# EAGLE board io-board-b-b (EAGLE 8.4.3)
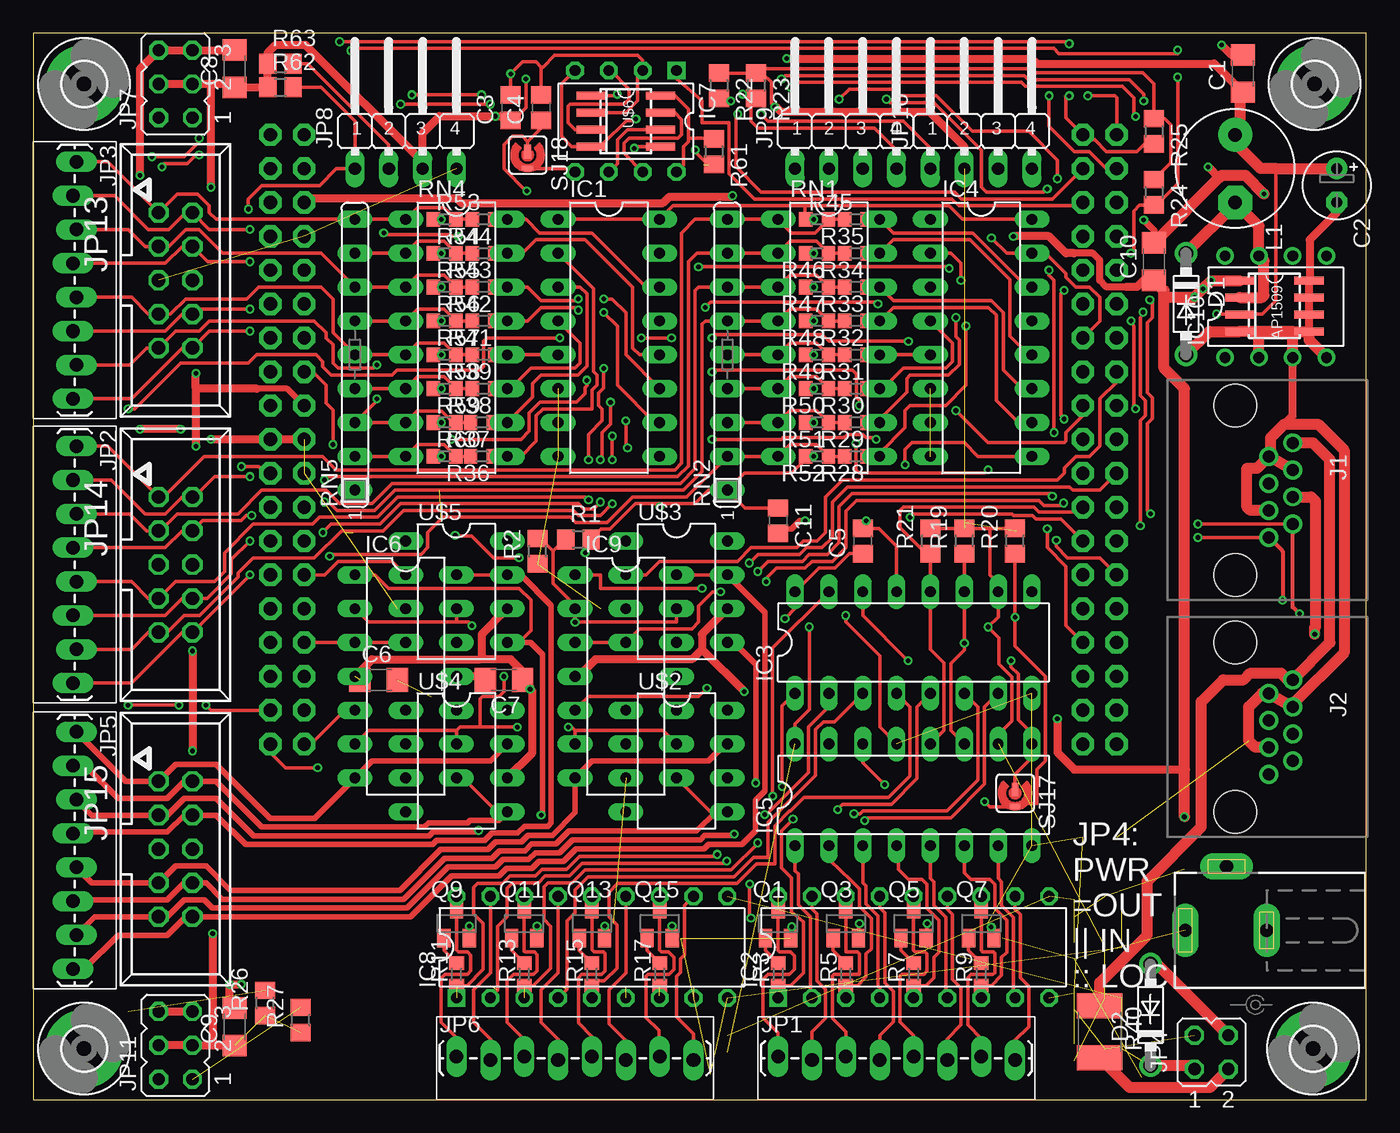
[diagram p2: board, top side]
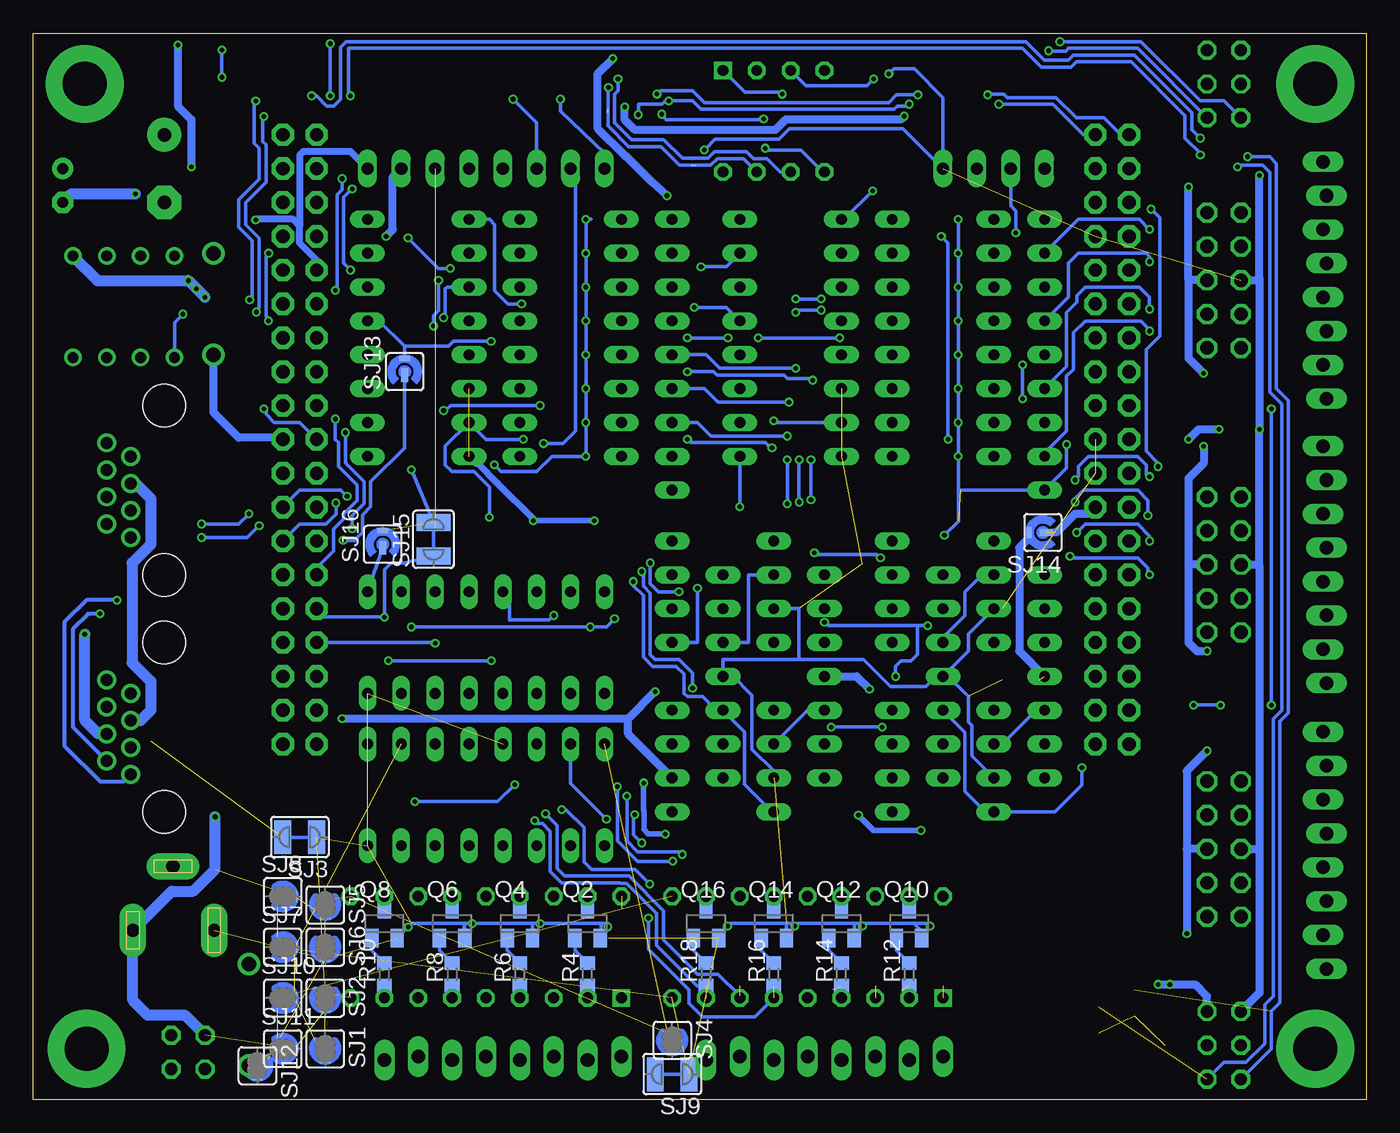
[diagram p3: board, bottom side, seen from below]

Size 100 x 80 mm. Coordinates in mm from the lower left corner, seen from the top.
Outline: 0,0 100,0 100,80 0,80 0,0
Copper layers (1*16): Top 0.035mm / dielectric 1.5mm / Bottom 0.035mm
Design rules "SeeedStudio_2layer_DRU_no_angle_20140221 *": minimum track width 6mil, minimum drill 12mil, track to track 10mil, track to pad 7mil, pad to pad 16mil, via to via 6mil, smd to smd 0mil, copper to edge 10mil, drill to drill 10mil, minimum pad ring 10mil, minimum via ring 6mil, stop-mask expansion 2mil, vias tented up to drill 100mil, thermal gap 10mil

## Footprints (pad centres in the part's own frame; a part is rotated, then mirrored left to right if it is on the bottom)
SO-08 = smd 0.6 x 2.2: 1 -1.905,-2.6; 2 -0.635,-2.6; 3 0.635,-2.6; 4 1.905,-2.6; 5 1.905,2.6; 6 0.635,2.6; 7 -0.635,2.6; 8 -1.905,2.6
C1206 = smd 1.6 x 1.8: 1 -1.4,0; 2 1.4,0
E2,5-5 = drill 0.813 pad 1.6: + -1.27,0 | drill 0.813 pad 1.6 octagon: - 1.27,0
C0805 = smd 1.3 x 1.5: 1 -0.95,0; 2 0.95,0
DO41-7.6 = drill 1.1 pad 1.7: A 3.81,0; C -3.81,0
3,3-PAD = drill 3.3 pad 5.842: B3,3 0,0
DIL16 = drill 0.813 long: 1 -8.89,-3.81; 2 -6.35,-3.81; 3 -3.81,-3.81; 4 -1.27,-3.81; 5 1.27,-3.81; 6 3.81,-3.81; 7 6.35,-3.81; 8 8.89,-3.81; 9 8.89,3.81; 10 6.35,3.81; 11 3.81,3.81; 12 1.27,3.81; 13 -1.27,3.81; 14 -3.81,3.81; 15 -6.35,3.81; 16 -8.89,3.81
DIL18-THIN = drill 0.813 square: 1 -10.16,-3.81 | drill 0.813 octagon: 2 -7.62,-3.81; 3 -5.08,-3.81; 4 -2.54,-3.81; 5 0,-3.81; 6 2.54,-3.81; 7 5.08,-3.81; 8 7.62,-3.81; 9 10.16,-3.81; 10 10.16,3.81; 11 7.62,3.81; 12 5.08,3.81; 13 2.54,3.81; 14 0,3.81; 15 -2.54,3.81; 16 -5.08,3.81; 17 -7.62,3.81; 18 -10.16,3.81
DIL14 = drill 0.813 long: 1 -7.62,-3.81; 2 -5.08,-3.81; 3 -2.54,-3.81; 4 0,-3.81; 5 2.54,-3.81; 6 5.08,-3.81; 7 7.62,-3.81; 8 7.62,3.81; 9 5.08,3.81; 10 2.54,3.81; 11 0,3.81; 12 -2.54,3.81; 13 -5.08,3.81; 14 -7.62,3.81
DIL08 = drill 0.813 square: 1 -3.81,-3.81 | drill 0.813 octagon: 2 -1.27,-3.81; 3 1.27,-3.81; 4 3.81,-3.81; 5 3.81,3.81; 6 1.27,3.81; 7 -1.27,3.81; 8 -3.81,3.81
DIL08' = drill 0.813 pad 1.27: 1 -3.81,-3.81; 2 -1.27,-3.81; 3 1.27,-3.81; 4 3.81,-3.81; 5 3.81,3.81; 6 1.27,3.81; 7 -1.27,3.81; 8 -3.81,3.81
RJ45-PULSE-E5J88 = drill 0.9 pad 1.422: 1 3.555,2.54; 2 2.535,4.32; 3 1.515,2.54; 4 0.495,4.32; 5 -0.495,2.54; 6 -1.515,4.32; 7 -2.535,2.54; 8 -3.555,4.32 | hole 3.2: 6.35,0; -6.35,0
DCJ0202 = drill 1 pad 2 long: 1 0,3.1; 2 4.8,0; 3 0,-3
1X08_TERMINAL = drill 1.016 long: 1 0,0.127; 2 2.54,-0.127; 3 5.08,0.127; 4 7.62,-0.127; 5 10.16,0.127; 6 12.7,-0.127; 7 15.24,0.127; 8 17.78,-0.127
JP2Q = drill 0.914 octagon: 1 -1.27,-1.27; 2 -1.27,1.27; 3 1.27,-1.27; 4 1.27,1.27
JP3Q = drill 0.914 octagon: 1 -2.54,-1.27; 2 -2.54,1.27; 3 0,-1.27; 4 0,1.27; 5 2.54,-1.27; 6 2.54,1.27
JP4F = drill 0.914 long: 1 -2.54,-1.27; 2 0,-1.27; 3 2.54,-1.27; 4 5.08,-1.27
CON10M = drill 1 octagon: 1 -5.08,-1.27; 2 -5.08,1.27; 3 -2.54,-1.27; 4 -2.54,1.27; 5 0,-1.27; 6 0,1.27; 7 2.54,-1.27; 8 2.54,1.27; 9 5.08,-1.27; 10 5.08,1.27
L5-8,5 = drill 1.016 pad 2.54: 1 -2.54,0 | drill 1.016 pad 2.54 octagon: 2 2.54,0
SOT23 = smd 1 x 1.4: 1 -0.95,-1.1; 2 0.95,-1.1; 3 0,1.1
R0805 = smd 1.3 x 1.5: 1 -0.95,0; 2 0.95,0
R0603 = smd 1 x 1.1: 1 -0.85,0; 2 0.85,0
PTC1812 = smd 1.9 x 3.4: 1 -1.95,0; 2 1.95,0
SIL9 = drill 0.813 long: 1 -10.16,0; 2 -7.62,0; 3 -5.08,0; 4 -2.54,0; 5 0,0; 6 2.54,0; 7 5.08,0; 8 7.62,0; 9 10.16,0
SJ-RND = smd 1.016 x 0.508: 1 -0.381,0 | smd 0.406 x 0.813: 2 0.889,0
SJW-C = smd 1.27 x 2.54: 1 -1.27,0; 2 1.27,0
SJ_RND2 = smd 1.016 x 0.508: P$1 -0.254,0 | smd 0.406 x 0.813: P$2 1.016,0
NUCLEO_BRD_BASE64 = drill 1 pad 1.676 octagon: 3V3 2.54,27.94; 5V2 2.54,25.4; AGND 63.5,7.62; AVDD 60.96,38.1; BOOT0 0,38.1; E5V 2.54,40.64; GND3 0,22.86; GND4 2.54,20.32; GND5 2.54,22.86; GND6 2.54,38.1; GND7 60.96,35.56; GND8 63.5,22.86; IOREF2 2.54,33.02; NC1-PF7 0,33.02; NC2-PF6 0,35.56; NC3 2.54,15.24; NC4 2.54,35.56; NC5-PD8 63.5,35.56; NC6-PB11 63.5,25.4; NC7-PF5 63.5,2.54; NC8-PF4 63.5,0; NRESET 2.54,30.48; PA0 2.54,12.7; PA1 2.54,10.16; PA2 60.96,2.54; PA3 60.96,0; PA4 2.54,7.62; PA5 60.96,33.02; PA6 60.96,30.48; PA7 60.96,27.94; PA8 60.96,17.78; PA9 60.96,20.32; PA10 60.96,5.08; PA11 63.5,30.48; PA12 63.5,33.02; PA13 0,30.48; PA14 0,27.94; PA15 0,25.4; PB0 2.54,5.08; PB1 63.5,17.78; PB2 63.5,20.32; PB3 60.96,7.62; PB4 60.96,12.7; PB5 60.96,10.16; PB6 60.96,25.4; PB7 0,20.32; PB8 60.96,43.18; PB9 60.96,40.64; PB10 60.96,15.24; PB12 63.5,27.94; PB13 63.5,10.16; PB14 63.5,12.7; PB15 63.5,15.24; PC0 2.54,0; PC1 2.54,2.54; PC2 0,2.54; PC3 0,0; PC4 63.5,5.08; PC5 63.5,40.64; PC6 63.5,43.18; PC7 60.96,22.86; PC8 63.5,45.72; PC9 60.96,45.72; PC10 0,45.72; PC11 2.54,45.72; PC12 0,43.18; PC13 0,17.78; PC14 0,15.24; PC15 0,12.7; PD2 2.54,43.18; PF0-PH0 0,10.16; PF1-PH1 0,7.62; U5V 63.5,38.1; VBAT 0,5.08; VDD 0,40.64; VIN2 2.54,17.78
DIL08-LONG = drill 0.813 long: 1 -3.81,-3.81; 2 -1.27,-3.81; 3 1.27,-3.81; 4 3.81,-3.81; 5 3.81,3.81; 6 1.27,3.81; 7 -1.27,3.81; 8 -3.81,3.81

## Placement (x,y rotation side)
+12V  9-15V  [POWER_USAGE]  91.69,7.11 270 top
AP1509  AP1509  [SO-08]  93.12,59.54 270 top
C1  [C1206]  90.73,76.99 90 top
C2  [E2,5-5]  97.79,68.58 270 top
C3  [C0805]  35.81,74.42 90 top
C4  [C0805]  38.1,74.42 90 top
C5  [C0805]  62.23,41.91 90 top
C6  [C1206]  25.91,31.5 0 top
C7  [C1206]  35.31,31.5 180 top
C8  [C1206]  15.11,77.34 90 top
C9  [C1206]  15.11,5.46 90 top
C10  [C1206]  84.07,62.87 90 top
C11  [C0805]  55.88,43.43 270 top
D1  [DO41-7.6]  86.49,59.69 270 top
D2  [DO41-7.6]  83.82,6.35 90 top
H1  MOUNT-PAD-ROUND3.3  [3,3-PAD]  3.81,76.2 0 top
H2  MOUNT-PAD-ROUND3.3  [3,3-PAD]  3.81,3.81 0 top
H3  MOUNT-PAD-ROUND3.3  [3,3-PAD]  96.01,3.81 0 top
H4  MOUNT-PAD-ROUND3.3  [3,3-PAD]  96.14,76.2 0 top
IC1  74166N  [DIL16]  43.18,57.15 270 top
IC2  [DIL18-THIN]  66.04,11.43 0 top
IC3  74HCT595N  [DIL16]  66.04,34.29 0 top
IC4  74166N  [DIL16]  71.12,57.15 270 top
IC5  74HCT595N  [DIL16]  66.04,22.86 0 top
IC6  LM324N  [DIL14]  27.94,31.75 270 top
IC7  PCA82C250  [DIL08]  44.45,73.41 180 top
IC8  [DIL18-THIN]  41.91,11.43 0 top
IC9  LM324N  [DIL14]  44.45,31.75 270 top
IC10  LM2574N-5.0  [DIL08']  93.22,59.49 0 top
J1  RJ45-JACKRJ45-PULSE-E5J00  [RJ45-PULSE-E5J88]  90.17,45.72 270 top
J2  RJ45-JACKRJ45-PULSE-E5J00  [RJ45-PULSE-E5J88]  90.17,27.94 270 top
J3  DCJ0202  [DCJ0202]  89.53,12.7 90 top
JP1  M08-SCREW  [1X08_TERMINAL]  55.88,3.1 0 top
JP2  M08-SCREW  [1X08_TERMINAL]  3.1,49.02 270 top
JP3  M08-SCREW  [1X08_TERMINAL]  3.1,70.36 270 top
JP4  [JP2Q]  88.39,3.56 0 top
JP5  M08-SCREW  [1X08_TERMINAL]  3.1,27.58 270 top
JP6  M08-SCREW  [1X08_TERMINAL]  31.75,3.1 0 top
JP7  [JP3Q]  10.67,76.2 90 top
JP8  [JP4F]  26.67,71.12 0 top
JP9  [JP4F]  59.69,71.12 0 top
JP10  [JP4F]  69.85,71.12 0 top
JP11  [JP3Q]  10.67,4.06 90 top
JP13  [CON10M]  10.67,61.47 270 top
JP14  [CON10M]  10.67,40.13 270 top
JP15  [CON10M]  10.67,18.8 270 top
L1  L-US  [L5-8,5]  90.17,69.85 270 top
Q1  [SOT23]  55.88,13.21 0 top
Q2  [SOT23]  58.42,13.21 0 bottom
Q3  [SOT23]  60.96,13.21 0 top
Q4  [SOT23]  63.5,13.21 0 bottom
Q5  [SOT23]  66.04,13.21 0 top
Q6  [SOT23]  68.58,13.21 0 bottom
Q7  [SOT23]  71.12,13.21 0 top
Q8  [SOT23]  73.66,13.21 0 bottom
Q9  [SOT23]  31.75,13.21 0 top
Q10  [SOT23]  34.29,13.21 0 bottom
Q11  [SOT23]  36.83,13.21 0 top
Q12  [SOT23]  39.37,13.21 0 bottom
Q13  [SOT23]  41.91,13.21 0 top
Q14  [SOT23]  44.45,13.21 0 bottom
Q15  [SOT23]  46.99,13.21 0 top
Q16  [SOT23]  49.53,13.21 0 bottom
R1  10k  [R0805]  40.89,42.04 0 top
R2  10k  [R0805]  37.85,41.15 90 top
R3  [R0603]  55.88,9.4 90 top
R4  [R0603]  58.42,9.4 90 bottom
R5  [R0603]  60.96,9.4 90 top
R6  [R0603]  63.5,9.4 90 bottom
R7  [R0603]  66.04,9.4 90 top
R8  [R0603]  68.58,9.4 90 bottom
R9  [R0603]  71.12,9.4 90 top
R10  [R0603]  73.66,9.4 90 bottom
R11  [R0603]  31.75,9.4 90 top
R12  [R0603]  34.29,9.4 90 bottom
R13  [R0603]  36.83,9.4 90 top
R14  [R0603]  39.37,9.4 90 bottom
R15  [R0603]  41.91,9.4 90 top
R16  [R0603]  44.45,9.4 90 bottom
R17  [R0603]  46.99,9.4 90 top
R18  [R0603]  49.53,9.4 90 bottom
R19  [R0805]  69.85,41.91 90 top
R20  [R0805]  73.66,41.91 90 top
R21  [R0805]  67.31,41.91 90 top
R22  [R0805]  51.44,76.07 270 top
R23  [R0805]  54.23,76.07 270 top
R24  [R0805]  84.07,68.07 270 top
R25  [R0805]  84.07,72.64 270 top
R26  [R0805]  17.4,7.24 90 top
R27  [R0805]  20.07,5.97 90 top
R28  [R0603]  61.72,48.26 180 top
R29  [R0603]  61.72,50.8 180 top
R30  [R0603]  61.72,53.34 180 top
R31  [R0603]  61.72,55.88 180 top
R32  [R0603]  61.72,58.42 180 top
R33  [R0603]  61.72,60.96 180 top
R34  [R0603]  61.72,63.5 180 top
R35  [R0603]  61.72,66.04 180 top
R36  [R0603]  33.66,48.26 180 top
R37  [R0603]  33.66,50.8 180 top
R38  [R0603]  33.78,53.34 180 top
R39  [R0603]  33.78,55.88 180 top
R40  0ZCG0035AF2C  [PTC1812]  80.01,5.08 270 top
R41  [R0603]  33.78,58.42 180 top
R42  [R0603]  33.78,60.96 180 top
R43  [R0603]  33.78,63.5 180 top
R44  [R0603]  33.78,66.04 180 top
R45  [R0603]  58.8,66.04 0 top
R46  [R0603]  58.8,63.5 180 top
R47  [R0603]  58.8,60.96 180 top
R48  [R0603]  58.8,58.42 180 top
R49  [R0603]  58.8,55.88 180 top
R50  [R0603]  58.8,53.34 180 top
R51  [R0603]  58.8,50.8 180 top
R52  [R0603]  58.8,48.26 180 top
R53  [R0603]  30.86,66.04 0 top
R54  [R0603]  30.86,63.5 0 top
R55  [R0603]  30.86,60.96 0 top
R56  [R0603]  30.86,58.42 0 top
R57  [R0603]  30.86,55.88 0 top
R58  [R0603]  30.86,53.34 0 top
R59  [R0603]  30.86,50.8 0 top
R60  [R0603]  30.86,48.26 0 top
R61  [R0805]  51.05,71.12 270 top
R62  [R0805]  18.54,75.95 0 top
R63  [R0805]  18.54,77.72 0 top
RN1  [DIL16]  59.69,57.15 270 top
RN2  10K  [SIL9]  52.07,55.88 90 top
RN4  [DIL16]  31.75,57.15 270 top
RN5  10K  [SIL9]  24.13,55.88 90 top
SJ1  [SJ-RND]  78.11,3.81 270 bottom
SJ2  [SJ-RND]  78.11,7.62 270 bottom
SJ3  [SJW-C]  80.01,19.68 180 bottom
SJ4  [SJ-RND]  52.07,4.45 270 bottom
SJ5  [SJ-RND]  78.11,14.61 270 bottom
SJ6  [SJ-RND]  78.11,11.43 270 bottom
SJ7  [SJ-RND]  81.28,11.43 0 bottom
SJ8  [SJ-RND]  81.28,15.24 0 bottom
SJ9  [SJW-C]  52.07,1.91 180 bottom
SJ10  [SJ-RND]  81.28,7.62 0 bottom
SJ11  [SJ-RND]  81.28,3.81 0 bottom
SJ12  [SJ-RND]  83.19,2.54 270 bottom
SJ13  [SJ_RND2]  72.14,54.61 90 bottom
SJ14  [SJ_RND2]  24.26,42.55 180 bottom
SJ15  [SJW-C]  69.98,42.04 90 bottom
SJ16  [SJ_RND2]  73.79,41.66 90 bottom
SJ17  [SJ_RND2]  73.66,22.99 270 top
SJ18  [SJ_RND2]  37.08,70.87 270 top
U$1  NUCLEO_64_GENERIC  [NUCLEO_BRD_BASE64]  17.78,26.67 0 top
U$2  TC4426APDIP  [DIL08-LONG]  48.26,25.4 270 top
U$3  TC4426APDIP  [DIL08-LONG]  48.26,38.1 270 top
U$4  TC4426APDIP  [DIL08-LONG]  31.75,25.4 270 top
U$5  TC4426APDIP  [DIL08-LONG]  31.75,38.1 270 top
U$6  MCP2551-SN  [SO-08]  44.45,73.41 270 top

## Tracks (layer width: path | path; a pad name or v marks a point on that pad's centre or on a via)
+3.3V  (via drill 0.35)  (1 unrouted)
  Top 0.254: U$1.3V3 20.95,54.61 21.97,53.59 21.97,52.24 22.48,51.73 v22.48,49.15 | v58.55,66.04 R45.1 57.91,66.08 57.91,67.06 | v58.55,63.5 R46.2 | v58.55,60.96 R47.2 | R48.2 v58.55,58.42 | v58.55,55.88 R49.2 | v58.55,53.34 R50.2 | v58.55,50.8 R51.2 | v58.55,48.26 R52.2 57.95,48.05 56.9,46.99 53.34,46.99 RN2.1 | R53.1 v30.61,66.04 | v30.61,48.26 R60.1 | R59.1 v30.6,50.8 | R58.1 v30.61,53.34 | R57.1 v30.61,55.88 | R56.1 v30.61,58.42 | R55.1 v30.61,60.96 | R54.1 v30.61,63.5 | 46.99,44.7 45.17,44.7 43.26,42.8 42.61,42.8 R1.2 41.4,41.59 v41.4,41.02 | 46.99,44.7 49.66,44.7 50.67,45.72 RN2.1 | v36.45,40.64 34.54,40.64 32.89,42.29 31.7,42.29 v31.65,42.34 | IC4.16 69.72,66.04 68.71,67.06 57.91,67.06 | 57.91,67.06 48.01,67.06 IC1.16 IC1.1 | 37.08,71.88 SJ18.P$1 | 37.08,71.88 38.1,72.9 C4.1 | v65.41,47.62 65.41,48.77 65.91,49.28 69.85,49.28 70.87,48.26 IC4.9 | v37.03,68.17 36.98,68.17 35.31,69.85 35.31,71.63 35.94,72.26 36.7,72.26 37.08,71.88 | v46.99,44.48 46.99,44.7 | C11.1 53.41,44.38 RN2.1
  Bottom 0.254: v22.48,49.15 22.48,47.37 RN5.1 30.43,45.72 | v30.61,50.8 v30.61,53.34 v30.61,55.88 v30.61,58.42 v30.61,60.96 v30.61,63.5 v30.61,66.04 | v30.61,50.8 v30.61,48.26 30.61,43.38 v31.65,42.34 | v30.6,50.8 v30.61,50.8 | v41.4,41.02 41.27,40.89 36.7,40.89 v36.45,40.64 | 58.17,66.04 v58.55,66.04 v58.55,63.5 v58.55,60.96 v58.55,58.42 v58.55,55.88 v58.55,53.34 v58.55,50.8 v58.55,48.26 61.09,48.26 62.23,47.12 64.9,47.12 v65.41,47.62 | IC1.1 39.17,66.04 v37.03,68.17 | IC1.9 v46.99,44.48
+5V  (via drill 0.35)  (7 unrouted)
  Top 0.254: v56.39,36.07 57.15,36.83 IC3.16 58.93,39.88 60.15,39.88 61.24,40.96 C5.1 | IC5.10 72.54,26.82 72.54,27.53 73.15,28.14 73.15,28.15 73.41,28.4 73.41,31.7 72.44,32.67 72.44,34.64 v71.63,35.46 72.39,36.22 IC3.10 72.39,38.73 71.75,39.37 71.75,42.86 | IC5.16 57.15,28.19 58.22,29.26 v58.22,35.46 | 71.75,42.86 R19.2 R21.2 | 71.75,42.86 R20.2 | U$6.3 40.64,72.77 40.13,73.28 40.13,74.55 40.26,74.68 44.32,74.68 44.7,75.06 44.7,75.82 43.31,77.22 IC7.3 | C8.1 15.5,76.33 | 36.96,76.33 v36.96,76.58 36.96,74.42 36.01,73.47 C3.1 | v55.63,74.47 55.37,74.73 55.37,76.33 54.68,77.02 R23.1 | R22.1 R23.1 | R23.1 54.55,77.34 74.55,77.34 74.85,77.04 83.24,77.04 84.07,76.2 R25.1 84.9,73.59 85.34,73.15 85.34,70.29 R24.1
  Top 0.457: U$1.5V2 19.05,53.34 16.76,53.34
  Top 0.61: 16.76,53.34 12.19,53.34 | 12.19,53.34 v12.19,49.02 | v11.94,33.66 v11.94,26.16 | JP11.4 JP11.3 13.46,4.06 | v13.46,12.45 13.46,4.06 | 13.46,4.06 C9.1 | 12.19,53.34 v12.19,54.48 | v13.34,68.45 13.34,76.2 | 13.34,76.2 JP7.3 JP7.4 | 13.34,76.2 14.85,76.2 C8.1 R62.1 R63.1 17.59,78.55 18.16,79.12 20.45,79.12 29.08,70.48 29.08,69.98 JP8.3 29.21,72.52 30.48,73.79 v34.67,73.79 35.5,73.79 C3.1 | JP10.2 69.85,71.5 67.26,74.09 56.13,74.09 55.75,74.47 v55.63,74.47
  Bottom 0.254: v56.39,36.07 57,35.46 v58.22,35.46 v71.63,35.46 | IC7.3 42.04,76.07 37.47,76.07 v36.96,76.58
  Bottom 0.61: v12.19,49.02 12.19,47.75 13.34,46.61 13.34,40.13 | JP14.6 13.34,40.13 | v11.94,33.66 12.7,33.66 13.34,34.29 13.34,40.13 | v11.94,26.16 13.46,24.64 13.46,18.8 | JP15.6 13.46,18.8 | 13.46,18.8 v13.46,12.45 | v12.19,54.48 13.34,55.63 13.34,61.47 | 13.34,61.47 v13.34,68.45 | JP13.6 13.34,61.47 | v34.67,73.79 34.92,73.53 43.56,73.53 44.35,72.75 54.84,72.75 55.63,73.53 v55.63,74.47
+12V  (via drill 0.35)  (5 unrouted)
  Top 0.508: 82.04,60.96 80.52,60.96 80.01,61.47 80.01,62.99 79.5,63.5 78.11,63.5
  Top 0.61: U$3.6 50.16,34.92 50.16,33.78 | 50.16,33.78 49.4,33.02 42.16,33.02 40.89,31.75 IC9.4 | 50.16,33.78 v53.34,30.61 | v76.83,28.57 76.83,26.04 78.11,24.77 86.36,24.77 | U$4.6 37.44,26.01 37.44,30.63 v37.27,30.8 37.27,30.93 C7.1 36.71,32.13 35.81,33.02 33.53,33.02 | U$5.6 33.66,34.92 33.66,33.27 33.72,33.21 33.53,33.02 | IC6.4 25.4,33.02 33.53,33.02 | C10.1 83.31,61.47 82.8,60.96 82.04,60.96 | v73.53,64.77 76.2,64.77 77.47,63.5 78.11,63.5
  Top 0.813: v86.36,21.21 86.36,24.77 86.36,53.34 84.84,54.86 84.84,60.2 | AP1509.1 v88.37,61.44 v87.76,60.83 v87.12,60.2 84.84,60.2 | 84.84,60.2 84.84,60.7 C10.1
  Bottom 0.61: 55.37,28.57 v53.34,30.61 | 55.37,28.57 v76.83,28.57 | U$2.6 55.37,27.43 55.37,28.57 | IC9.4 38.23,31.75 v37.27,30.8 | SJ14.P$2 25.27,42.16 26.04,41.4 26.04,33.66 IC6.4 | v73.53,64.77 73.03,65.28 73.03,69.22 JP10.3
  Bottom 0.813: JP4.2 88.65,6.35 91.44,6.35 92.53,7.45 J3.3 89.61,15.62 88.01,15.62 86.36,17.27 v86.36,21.21 | IC10.5 95.17,61.44 v88.37,61.44 | 88.39,61.47 v87.12,60.2
CAN_RS
  Top 0.254: U$6.8 48.13,75.31 49.15,74.3 49.15,72.14 | IC7.8 48.77,70.1 48.77,71.5 49.15,71.88 49.15,72.14 | R61.1 50.99,72.14 49.15,72.14
CAN_VIO  (via drill 0.35)
  Top 0.254: U$6.5 45.21,71.5 v45.09,71.37 | SJ18.P$2 40.13,69.85 40.39,69.6 IC7.5
  Bottom 0.254: v45.09,71.37 44.96,71.37 44.83,71.25 42.42,71.25 40.77,69.6 IC7.5
CANH  (via drill 0.35)  (2 unrouted)
  Top 0.254: U$6.7 48.13,74.04 48.64,73.53 48.64,72.39 48.39,72.14 44.7,72.14 44.32,71.75 44.32,70.99 IC7.7 | v56.85,75.95 57.23,76.33 74.13,76.33 74.43,76.02 81.71,76.02 82.55,75.18 82.55,73.86 v82.7,73.76 | v83.26,59.08 83.26,58.88 83.06,58.67 83.06,52.83 83.44,52.45 83.44,51.31 83.06,50.93 v83.06,43.05 | J1.1 v87.38,42.16
  Top 0.305: J1.1 93.73,41.15 v93.73,37.47
  Bottom 0.254: IC7.7 46.74,70.61 48.68,70.61 49.19,70.1 50.67,70.1 | 50.29,70.1 51.52,70.1 52.91,71.5 55.33,71.5 56.9,73.07 56.9,74.3 | v56.85,75.95 56.85,75.69 56.9,75.65 56.9,74.04 | v82.7,73.76 82.8,73.66 82.8,71.88 82.55,71.63 82.55,68.83 84.07,67.31 84.07,65.66 83.06,64.64 83.06,59.44 83.14,59.36 83.14,59.08 v83.26,59.08 | v87.38,42.16 83.95,42.16 v83.06,43.05
  Bottom 0.305: v93.73,37.47 96.01,37.47 97.66,35.81 97.66,26.54 95,23.88 93.22,23.88 J2.1
CANL  (via drill 0.35)
  Top 0.254: U$6.6 44.58,72.77 43.81,72.01 43.81,70.23 IC7.6 | v56.13,76.58 56.39,76.83 74.34,76.83 74.64,76.53 82.22,76.53 83.31,75.44 v83.31,74.93 | v83.77,59.99 83.95,59.82 83.95,58.67 83.57,58.29 83.57,53.04 83.95,52.66 83.95,51.1 83.57,50.72 83.57,44.2 v83.82,43.94 | J1.2 v87.38,43.19 v87.38,43.18
  Top 0.305: J1.2 94.49,36.95 v95,36.45
  Bottom 0.254: IC7.6 43.94,69.6 44.96,70.61 45.97,70.61 46.48,71.12 48.89,71.12 49.4,70.61 50.54,70.61 | 50.55,70.61 50.54,70.61 | 50.54,70.61 51.31,70.61 52.7,72.01 55.12,72.01 56.39,73.28 56.39,75.44 56.13,75.69 v56.13,76.58 | v83.31,74.93 83.44,74.8 83.44,71.75 83.06,71.37 83.06,69.04 84.58,67.52 84.58,65.45 83.57,64.43 83.57,60.2 v83.77,59.99 | v87.38,43.18 84.58,43.18 v83.82,43.94
  Bottom 0.305: v95,36.45 95.89,36.45 97.03,35.31 97.03,27.94 J2.2
CANRX  (via drill 0.35)
  Top 0.254: U$6.4 40.39,71.5 39.62,72.26 39.62,76.2 IC7.4 | U$1.PB8 76.45,67.56 69.64,67.56 69.13,68.07 54.61,68.07 52.7,69.98 52.7,73.79 v52.86,73.94 | U$6.4 42.67,71.5 | U$6.4 42.8,71.5 42.8,71.75 44.5,73.46 45.14,73.46 45.21,73.53 v45.21,73.58
  Bottom 0.254: v45.21,73.58 45.29,73.53 52.52,73.53 v52.86,73.94
CANTX  (via drill 0.35)
  Top 0.254: U$6.1 43.69,75.31 v43.81,75.44 | U$1.PB9 78.49,67.06 69.42,67.06 68.92,67.56 54.1,67.56 52.2,69.47 52.2,73.28 50.16,73.28 50.16,74.93 48.26,76.58 IC7.1
  Bottom 0.254: v43.81,75.44 43.94,75.56 46.61,75.56 IC7.1
CMPREF  (via drill 0.35)
  Top 0.254: IC9.13 48.26,35.81 v40.64,35.81 IC9.2 40.64,37.08 38.99,38.73 38.99,41.15 | IC9.9 47.24,27.69 40.64,27.69 | 40.64,27.69 IC9.6 | IC6.2 25.15,35.81 31.75,35.81 | IC6.13 31.75,35.81 | IC6.6 25.15,27.69 31.75,27.69 | IC6.9 31.75,27.69 | 31.75,35.81 32.64,35.81 v32.89,35.56 | 31.75,27.69 32,27.94 33.53,27.94 | 33.53,27.94 v36.32,27.94 | v40.13,27.94 40.39,27.94 40.64,27.69 | 33.53,27.94 33.53,30.05 33.71,30.23 34.92,30.23 35.31,30.61 v35.31,31.75 | 38.99,41.15 38.04,42.1 R2.2 | 38.99,41.15 39.88,42.04 R1.1
  Bottom 0.254: 33.66,35.56 v32.89,35.56 | 33.66,35.56 40.39,35.56 v40.64,35.81 | v36.32,27.94 v40.13,27.94 | 33.66,35.56 33.68,35.53 33.66,35.51 33.66,33.4 34.16,32.89 34.92,32.89 35.31,32.51 v35.31,31.75
E_CS  (via drill 0.35)
  Top 0.254: v28.4,75.39 v33.63,75.39 | v53.21,75.44 53.91,75.44 R23.2 53.85,74.74 53.85,73.41 54.36,72.9 55.12,72.9 55.24,72.9 63.12,72.9 64.77,71.25 JP9.4
  Bottom 0.254: U$1.PC10 18.41,72.39 19.68,73.66 21.76,73.66 23.29,75.18 26.92,75.18 27.18,75.44 28.35,75.44 v28.4,75.39 | v33.63,75.39 35.23,75.39 35.81,74.8 49.66,74.8 50.55,75.69 52.96,75.69 v53.21,75.44
E_LAT  (via drill 0.35)
  Top 0.254: v27.56,74.68 v34.29,74.68 | v52.32,74.93 51.63,74.93 R22.2 | JP10.1 67.31,71.37 65.28,73.41 55.12,73.41 v54.61,73.89
  Bottom 0.254: U$1.PC11 21.21,72.39 23.5,74.68 v27.56,74.68 | v34.29,74.68 34.42,74.55 35.18,74.55 35.43,74.3 49.91,74.3 50.55,74.93 v52.32,74.93 52.58,74.93 52.83,74.68 54.61,74.68 v54.61,73.89
E_MOSI  (via drill 0.35)  (1 unrouted)
  Top 0.254: v71.63,47.24 71.37,46.99 61.98,46.99 61.72,47.24 v61.72,49.23
  Bottom 0.254: JP9.2 59.31,69.47 59.31,50.16 60.25,49.23 v61.72,49.23 | SJ15.2 v71.63,47.24
GND  (via drill 0.35)  (20 unrouted)
  Top 0.254: Q1.2 56.83,12.95 v56.9,12.95 | Q3.2 61.91,13.21 v61.98,13.21 | 66.93,12.11 Q5.2 67.06,12.11 v67.06,13.21 | Q7.2 72.07,12.95 v71.87,12.95 | Q13.2 42.88,12.12 v42.88,13.01 | Q11.2 37.8,12.12 v37.8,13.01 | Q9.2 32.72,12.12 v32.72,13.01 | Q15.2 47.94,12.69 v47.92,13.02 | U$6.2 44.45,74.04 45.34,74.93 45.34,76.83 IC7.2 45.72,77.98 45.34,78.36 39.12,78.36 38.23,77.47 38.1,77.47 | C3.2 v35.81,76.96 36.7,77.85 37.72,77.85 38.1,77.47 | 38.1,77.47 C4.2 | R61.2 50.74,70.48 50.29,70.48 49.66,71.12 v49.66,71.25 | IC3.13 64.77,41.53 63.44,42.86 61.91,42.86 | IC5.13 63.5,27.94 63.5,33.27 60.96,35.81 v60.96,36.32
  Top 0.406: C11.2 56.2,42.8 56.9,42.8 57.53,43.43 v57.91,43.43
  Top 0.508: v83.31,65.99 84.07,65.23 C10.2 | v62.48,43.43 61.91,42.86 C5.2
  Top 0.61: C2.- 97.79,66.55 95.76,64.52 95.76,61.48 AP1509.8 AP1509.7 AP1509.6 AP1509.5 | C7.2 33.65,31.75 IC6.11 | C9.2 14.73,7.24 v14.73,8.64 v15.62,8.64 | JP11.6 JP11.5 | C8.2 JP7.5 JP7.6 8,77.34 v8,69.34 | U$1.GND5 U$1.GND3 v13.34,49.53 | v11.05,50.29 v8,50.29 | C1.2 89.89,78.39 v89.15,79.12 | v88.14,69.98 88.96,69.15 | 93.85,50.67 94.49,51.31 IC10.3
  Top 0.813: J1.6 J1.7 | J1.3 91.31,44.2 91.06,44.45 91.06,47.37 91.83,47.37 J1.7 | J2.3 91.69,26.43 91.19,26.92 91.19,29.46 92.2,30.48 J2.7 J2.6 94.49,29.66 98.35,33.52 98.35,48.72 96.39,50.67 93.85,50.67 92.84,49.66 92.84,48.38 J1.7 | D1.A 88.24,57.63 AP1509.4 91.82,57.63 | 94.49,57.63 91.82,57.63 | 94.49,57.63 AP1509.5 95.72,56.99 IC10.4 | IC10.2 91.95,57.51 91.82,57.63 | IC10.3 94.49,57.63 | C10.2 88.96,69.15 89.15,69.34 90.93,69.34 v92.33,67.94
  Bottom 0.254: Q8.2 v71.87,12.95 71.61,13.21 67.69,13.21 67.69,12.17 Q6.2 67.63,13.21 v67.06,13.21 62.55,13.21 | 57.4,13.21 57.4,12.11 Q2.2 | 62.55,13.21 v61.98,13.21 57.4,13.21 | Q4.2 62.55,13.21 | v56.9,12.95 56.9,13.21 57.4,13.21 | Q16.2 v47.92,13.02 47.73,13.21 43.48,13.21 | Q10.2 33.34,12.61 33.93,13.21 | 42.88,13.21 43.48,13.21 | 42.88,13.21 38.41,13.21 | 37.8,13.21 33.93,13.21 | 37.8,13.21 38.41,13.21 | Q12.2 38.41,12.12 38.41,13.21 | Q14.2 43.48,12.12 43.48,13.21 | v42.88,13.01 42.88,13.21 | v32.72,13.01 32.72,13.21 33.93,13.21 | v37.8,13.01 37.8,13.21 | U$3.3 42.55,36.83 42.55,33.02 | 42.55,33.02 48.26,33.02 IC9.11 48.13,31.88 47.62,31.88 46.08,30.33 46.08,26.27 44.45,24.64 U$2.3 | 27.3,36.83 U$5.3 29.84,34.92 29.84,33.66 31.56,31.94 | 31.56,31.94 IC6.11 32.26,31.75 33.02,30.99 35.69,30.99 37.72,33.02 42.55,33.02 | U$4.3 29.59,25.78 29.59,28.07 29.84,28.32 29.84,30.23 31.56,31.94 | v49.66,71.25 48.84,72.06 44.06,72.06 43.28,72.85 34.75,72.85 JP8.4 31.75,75.18 33.91,77.34 35.43,77.34 v35.81,76.96 | v60.96,36.32 61.32,35.97 64.26,35.97 64.26,37.59 IC3.13
  Bottom 0.406: v57.91,43.43 62.36,43.43 62.48,43.56
  Bottom 0.508: U$1.GND7 78.74,62.97 80.01,64.24 80.01,65.53 | 80.01,65.53 80.52,66.04 83.26,66.04 v83.31,65.99 | JP10.4 76.2,71.12 79.76,71.12 80.01,70.87 80.01,65.53 | IC4.8 66.8,47.75 66.67,47.75 65.15,46.24 65.15,46.23 62.48,43.56 v62.48,43.43
  Bottom 0.61: JP11.5 11.94,7.75 12.83,8.64 v14.73,8.64 v15.62,8.64 | v13.34,49.53 12.57,50.29 v11.05,50.29 | 8,61.59 v8,69.34 | 8,61.59 v8,50.29 8,40.01 | JP11.6 8,8 8,18.8 | 8,40.01 8,18.8 | JP15.5 8,18.8 | JP14.5 8.13,40.13 8,40.01 | JP13.5 8.13,61.47 8,61.59 | v89.15,79.12 89.15,74.55 88.14,73.53 v88.14,69.98 | U$1.GND8 81.41,49.66 84.58,49.66 86.49,51.56 D1.A
  Bottom 0.813: v92.33,67.94 97.16,67.94 C2.-
I2CSCL  (via drill 0.35)
  Top 0.254: JP8.2 26.67,71.63 20.57,77.72 R63.2 | v26.29,65.02 26.42,64.9 31.24,64.9 31.37,64.77 v31.88,64.77 | v31.37,49.53 36.58,49.53 37.21,50.16 37.21,51.52 38.02,52.32 40.77,52.32 41.4,52.96 41.4,53.42 41.53,53.55 v41.53,53.98 | v50.93,54.61 51.05,54.74 61.47,54.74 61.77,54.44 61.77,52.66 61.98,52.45 v61.98,52.07 | v69.22,51.69 71.63,49.28 77.34,49.28 77.47,49.4 77.47,50.04 78.74,51.31 U$1.PB6
  Bottom 0.254: JP8.2 26.67,67.06 26.29,66.67 v26.29,65.02 | v31.88,64.77 31.37,64.26 v31.37,49.53 | v41.53,53.98 41.66,54.1 43.43,54.1 43.69,54.36 48.72,54.36 48.98,54.61 v50.93,54.61 | v61.98,52.07 68.71,52.07 69.09,51.69 v69.22,51.69
I2CSDA  (via drill 0.35)
  Top 0.254: U$1.PB7 17.4,46.99 16.89,47.5 v15.62,47.5 | v16.13,66.8 16.13,67.56 17.14,68.58 21.46,68.58 22.73,69.85 JP8.1 24.13,73.41 21.59,75.95 R62.2
  Bottom 0.254: v15.62,47.5 15.62,47.75 16.51,48.64 16.51,56.26 15.49,57.28 15.49,66.17 v16.13,66.8
ILAT  (via drill 0.35)
  Top 0.254: v68.71,62.36 68.58,62.48 v49.91,62.48 | v71.88,64.64 73.03,63.5 IC4.15 75.95,63.5 77.47,61.98 77.47,61.72 78.23,60.96 79.25,60.96 80.01,60.2 80.01,58.42 U$1.PA6
  Bottom 0.254: IC1.15 48.01,62.48 v49.91,62.48 | v68.71,62.36 69.6,62.36 v71.88,64.64
MISO  (via drill 0.35)
  Top 0.254: v60.45,75.06 61.21,75.82 64.52,75.82 65.02,75.31 67.77,75.31 70.44,72.64 74.68,72.64 76.83,70.48 v76.83,69.09 | v77.34,60.71 77.09,60.45 77.09,51.31 v77.34,51.05
  Bottom 0.254: JP9.1 57.15,70.99 60.45,74.17 v60.45,75.06 | v76.83,69.09 76.83,68.28 77.22,67.9 77.22,60.83 v77.34,60.71 | v77.34,51.05 77.34,49.53 77.09,49.28 77.09,47.5 75.69,46.1 75.69,44.96 76.71,43.94 76.71,43.56 77.47,42.8 77.47,41.15 78.74,39.88 U$1.PB4
MISO2  (via drill 0.35)
  Top 0.254: U$1.PC2 13.34,29.21 v12.95,29.59 | v10.92,29.59 v7.11,29.59 | v65.66,56.9 59.69,56.9 59.18,57.4 51.18,57.4 v50.93,57.15 | v47.88,57.15 v45.62,57.15 | v7.11,51.82 7.62,51.82 11.05,55.24 16.13,55.24 16.76,55.88 21.21,55.88 21.72,55.37 21.72,54.99 22.35,54.36 26.92,54.36 27.3,54.74 33.53,54.74 33.78,54.99 33.78,56.9 34.04,57.15 v39.5,57.15
  Bottom 0.254: v12.95,29.59 v10.92,29.59 | v7.11,29.59 v7.11,51.82 | IC4.13 74.04,58.42 72.14,56.52 | v65.66,56.9 68.45,56.9 68.83,56.52 72.14,56.52 | v50.93,57.15 v47.88,57.15 | v45.62,57.15 v39.5,57.15 | SJ13.P$2 72.14,56.52
MISO2_ALT  (via drill 0.35)
  Top 0.254: U$1.PB14 80.01,40.64 77.6,40.64 76.76,41.48 v76.76,41.96
  Bottom 0.254: v76.76,41.96 75.77,41.96 75.69,42.04 75.69,42.16 75.31,42.55 75.31,43.86 74.68,44.49 74.68,46.35 72.14,48.9 SJ13.P$1
MOSI  (via drill 0.35)
  Top 0.254: R20.1 v73.66,36.2 73.66,34.04 75.95,31.75 75.95,25.4 75.31,24.77 75.31,22.23 74.14,22.23 74.14,22.22 74.1,22.22 74.06,22.2 74.02,22.18 74,22.15 73.97,22.14 73.95,22.13 73.91,22.14 73.86,22.13 73.82,22.12 73.79,22.09 73.78,22.09 SJ17.P$2 71.75,21.97 v71.37,22.35 | v63.88,23.62 62.23,25.27 IC5.14
  Bottom 0.254: U$1.PB5 78.74,36.2 v73.66,36.2 73.66,39.75 73.15,40.26 72.14,40.26 SJ15.1 | v71.37,22.35 65.15,22.35 v63.88,23.62
N$1  (via drill 0.35)
  Top 0.254: IC2.1 R3.1 56.81,8.55 57.78,9.53 57.78,13.34 56.9,14.1 56.9,16.64 56.13,17.4 56.13,20.17 v57,21.03
  Bottom 0.254: v57,21.03 59.69,23.72 IC5.15
N$2  (1 unrouted)
  Top 0.254: IC2.18 55.88,11.18 55.98,11.07 56.79,11.07 57.1,10.77 57.1,9.75 56.74,9.4 55.12,9.4 54.74,9.02 54.74,6.15 55.88,5 JP1.1
N$3
  Top 0.254: IC5.1 57.15,17.17 57.4,16.92 57.4,14.61 58.29,13.72 58.29,7.75 IC2.2
  Bottom 0.254: R4.1 IC2.2
N$4  (via drill 0.35)
  Top 0.813: J1.4 95.87,45.23 96.22,44.88 96.22,35.48 96.14,35.41 v96.14,34.92
  Bottom 0.813: J2.4 95.14,27.45 96.14,28.45 v96.14,34.92
N$5
  Bottom 0.813: J1.5 92.32,46.22 91.19,45.09 91.19,41.66 92.58,40.26 92.58,32.77 91.19,31.37 91.19,29.21 91.96,28.43 J2.5
N$6  (via drill 0.35)
  Top 0.254: JP3.8 7.37,52.58 11.18,56.39 JP13.10 13.21,57.66 v16.26,57.66 | RN5.2 RN4.8 28.83,49.15 30.82,49.15 R60.2 R36.2
  Bottom 0.254: RN5.2 24.13,48.51 22.48,50.16 22.48,54.27 21.97,54.78 21.97,57.53 21.08,58.42 16.89,58.42 16.26,57.78 v16.26,57.66
N$7
  Top 0.254: IC2.17 Q2.3 58.8,13.93 58.8,8.89 59.44,8.26 59.44,6.1 58.42,5.08 JP1.2 58.8,3.35
  Bottom 0.254: Q2.3 IC2.17
N$8
  Top 0.254: IC5.2 59.69,18.03 59.77,17.96 61.35,16.43 61.98,15.81 61.98,14.48 62.87,13.59 62.87,11.3 62.48,10.92 62.48,9.19 61.84,8.55 R5.1 IC2.3
N$9
  Top 0.254: IC2.16 Q3.3 60.96,11.08 61.82,11.08 61.98,10.92 61.98,9.4 60.07,9.4 59.94,9.27 59.94,6.1 60.96,5.08 JP1.3
N$10
  Top 0.254: IC5.3 62.23,16.27 62.48,16.02 62.48,14.69 63.37,13.8 63.37,8.51 63.5,8.38 IC2.4
  Bottom 0.254: R6.1 IC2.4
N$11
  Top 0.254: IC2.15 63.5,14.39 63.88,14.01 63.88,8.76 64.52,8.13 64.52,5.84 63.5,4.83 JP1.4
  Bottom 0.254: Q4.3 IC2.15
N$12
  Top 0.254: IC5.4 64.9,18.92 64.9,17.27 65.66,16.51 66.67,16.51 67.06,16.13 67.06,14.35 67.94,13.46 67.94,11.05 67.56,10.67 67.56,9.14 66.97,8.55 R7.1 IC2.5
N$13
  Top 0.254: IC2.14 Q5.3 66.04,11.18 66.14,11.07 66.9,11.07 67.06,10.92 67.06,9.65 66.8,9.4 65.15,9.4 65.02,9.27 65.02,5.84 66.04,4.83 JP1.5
N$14  (via drill 0.35)
  Top 0.254: JP3.7 7.24,55.12 8.51,56.39 JP13.9 10.67,57.66 12.45,57.66 13.21,58.42 21.08,58.42 21.97,57.53 21.97,57.15 22.48,56.64 22.48,55.24 22.86,54.86 25.53,54.86 v25.78,55.12 | R37.2 R59.2 31.49,50.8 30.64,51.66 28.8,51.66 RN4.7 RN5.3 25.78,52.45 v25.78,52.58
  Bottom 0.254: v25.78,55.12 v25.78,52.58
N$15  (via drill 0.35)
  Top 0.254: JP3.6 9.91,57.66 11.18,58.93 JP13.8 12.32,59.31 v16.26,59.31 | RN5.4 RN4.6 28.83,54.23 30.82,54.23 R58.2 R38.2
  Bottom 0.254: RN5.4 22.48,54.99 22.48,59.05 21.72,59.82 21.72,60.33 21.08,60.96 17.02,60.96 16.26,60.2 v16.26,59.31
N$16
  Bottom 0.254: R6.2 64.45,11.2 Q4.1
N$17
  Top 0.254: IC5.5 67.31,16.59 67.56,16.34 67.56,14.56 68.45,13.67 68.45,7.75 IC2.6
  Bottom 0.254: IC2.6 R8.1
N$18
  Top 0.254: IC2.13 68.58,14.26 68.96,13.88 68.96,9.02 69.6,8.38 69.6,5.59 68.58,4.57 JP1.6
  Bottom 0.254: Q6.3 IC2.13
N$19  (via drill 0.35)
  Top 0.254: JP3.4 9.91,62.74 11.18,64.01 JP13.4 13.08,62.87 v16.26,62.87 | RN5.6 RN4.4 28.83,59.31 30.82,59.31 R56.2 R41.2
  Bottom 0.254: RN5.6 22.35,60.2 22.35,62.74 21.59,63.5 16.51,63.5 16.26,63.25 v16.26,62.87
N$20
  Top 0.254: JP3.3 7.11,65.28 8.38,64.01 JP13.3 10.16,64.01 11.43,65.28 12.45,65.28 14.22,63.5 21.59,63.5 RN5.7 RN4.3 28.83,61.85 30.82,61.85 R55.2 R42.2
N$21  (via drill 0.35)
  Top 0.254: JP2.6 9.91,36.32 11.18,37.59 JP14.8 13.04,37.59 14.86,39.41 14.86,40.51 v16.26,41.91 | RN2.4 RN1.6 56.77,54.23 58.76,54.23 R50.1 R30.2 | v21.72,42.55 22.35,43.18 26.03,43.18 27.55,44.7 40.89,44.7 41.27,44.32 42.04,44.32 v42.55,44.83 | v43.31,52.32 43.31,50.67 42.67,50.04 42.67,48.13 v42.55,48.01
  Bottom 0.254: RN2.4 49.66,53.34 48.64,52.32 v43.31,52.32 | v21.72,42.55 21.08,43.18 17.14,43.18 16.26,42.29 v16.26,41.91 | v42.55,48.01 v42.55,44.83
N$22
  Top 0.254: R44.2 R53.2 30.82,66.93 28.83,66.93 RN4.1 RN5.9 13.72,66.04 13.21,66.55 13.21,67.06 12.32,67.94 10.79,67.94 JP13.1 5.59,70.36 JP3.1
N$23
  Top 0.254: IC1.2 42.04,60.83 42.04,54.61 42.17,54.48 42.29,54.35 42.29,53.59 41.91,53.21 41.91,51.82 38.23,51.82 37.72,51.31 37.72,49.4 36.58,48.26 RN4.9 R36.1
N$24
  Top 0.254: IC1.3 41.02,60.96 41.53,60.45 41.53,55.03 40.85,54.36 38.1,54.36 37.47,53.72 37.47,52.7 RN4.10 R37.1
N$25  (via drill 0.35)
  Top 0.254: JP2.8 7.37,31.24 11.18,35.05 JP14.10 v16.26,39.37 | v22.23,40.77 22.35,40.89 29.08,40.89 29.59,41.4 29.59,42.55 30.73,43.69 40.3,43.69 40.68,43.31 43.05,43.31 44.96,45.21 49.02,45.21 RN2.2 RN1.8 56.77,49.15 58.76,49.15 R52.1 R28.2
  Bottom 0.254: v22.23,40.77 22.1,40.64 17.14,40.64 16.38,39.88 16.38,39.5 v16.26,39.37
N$26  (via drill 0.35)
  Top 0.254: JP2.7 7.37,33.78 8.64,35.05 JP14.9 10.03,35.05 11.3,36.32 12.49,36.32 15.37,39.2 15.37,39.5 16.51,40.64 21.08,40.64 23.11,42.67 26.24,42.67 27.77,44.2 40.51,44.2 40.89,43.81 42.55,43.81 v43.43,44.7 | RN2.3 RN1.7 56.77,51.69 58.76,51.69 R51.1 R29.2 | v43.43,49.78 v43.43,48.01
  Bottom 0.254: RN2.3 50.16,50.8 49.15,49.78 v43.43,49.78 | v43.43,48.01 v43.43,44.7
N$27
  Top 0.254: R7.2 65.09,11.2 Q5.1
N$28  (via drill 0.35)
  Top 0.254: JP2.5 7.37,38.86 8.64,37.59 JP14.7 10.67,38.86 13.59,38.86 14.35,39.62 14.35,41.02 16.51,43.18 20.95,43.18 21.46,43.69 25.82,43.69 27.34,45.21 41.4,45.21 41.6,45.01 v41.66,45.01 | RN2.5 RN1.5 56.77,56.77 58.76,56.77 R49.1 R31.2 | v42.8,54.86 42.8,53.38 42.42,53 42.42,52.07 42.67,51.82 42.67,50.93 41.66,49.91 v41.66,48.01
  Bottom 0.254: RN2.5 49.53,55.88 48.51,54.86 v42.8,54.86 | v41.66,48.01 v41.66,45.01
N$29
  Top 0.254: IC1.4 41.02,56.77 41.02,55.24 40.64,54.86 37.34,54.86 35.81,53.34 RN4.11 R38.1
N$30
  Top 0.254: IC1.5 RN4.12 R39.1
N$31  (via drill 0.35)
  Top 0.254: v40.9,59.23 40.9,59.31 40.77,59.44 38.1,59.44 37.08,58.42 RN4.13 R41.1 | v42.8,59.05 43.81,58.04 43.81,53.59 46.61,50.8 IC1.10
  Bottom 0.254: v40.9,59.23 42.62,59.23 v42.8,59.05
N$32  (via drill 0.35)
  Top 0.254: v40.89,60.07 40.77,59.94 38.1,59.94 37.08,60.96 RN4.14 R42.1 | v42.8,60.07 43.43,60.07 44.45,59.05 44.45,55.88 IC1.11
  Bottom 0.254: v40.89,60.07 v42.8,60.07
N$33  (via drill 0.35)
  Top 0.254: JP2.4 9.91,41.4 11.18,42.67 JP14.4 12.7,43.43 15.58,43.43 15.96,43.81 v16.38,43.81 | v21.84,44.83 21.89,44.79 22.18,44.79 22.78,44.2 25.61,44.2 27.13,45.72 48.76,45.72 50.16,47.12 50.16,58.17 50.42,58.42 RN2.6 RN1.4 56.77,59.31 58.76,59.31 R48.1 R32.2
  Bottom 0.254: v21.84,44.83 21.84,45.09 21.21,45.72 17.14,45.72 16.38,44.96 v16.38,43.81
N$34
  Top 0.254: JP2.3 7.24,43.94 8.51,42.67 JP14.3 9.53,42.67 10.79,43.94 15.37,43.94 17.14,45.72 21.97,45.72 22.99,44.7 25.4,44.7 26.92,46.23 48.55,46.23 49.66,47.33 49.66,60.71 49.91,60.96 RN2.7 RN1.3 56.77,61.85 58.76,61.85 R47.1 R33.2
N$35  (via drill 0.35)
  Top 0.254: v16.26,46.74 13.59,46.74 12.06,45.21 JP14.2 11.18,45.21 9.91,43.94 8.38,43.94 5.84,46.48 JP2.2 | v21.84,46.48 22.1,46.74 48.34,46.74 49.15,47.54 49.15,62.87 49.78,63.5 RN2.8 RN1.2 56.77,64.39 58.76,64.39 R46.1 R34.2
  Bottom 0.254: v16.26,46.74 16.38,46.74 16.51,46.86 16.51,47.62 17.14,48.26 20.83,48.26 21.59,47.5 21.59,46.74 v21.84,46.48
N$36
  Top 0.254: R35.2 R45.2 58.63,65.02 56.9,65.02 RN1.1 RN2.9 49.66,66.04 48.64,65.02 48.64,47.75 48.13,47.24 22.73,47.24 21.72,48.26 12.83,48.26 9.78,45.21 JP14.1 5.59,49.02 JP2.1
N$37
  Top 0.254: R43.1 RN4.15 36.7,63.5 37.72,64.52 41.4,64.52 44.96,60.96 44.96,56.39 45.47,55.88 IC1.12
N$38
  Top 0.254: IC1.14 45.97,60.96 41.91,65.02 37.97,65.02 36.96,66.04 RN4.16 R44.1
N$39
  Top 0.254: IC5.6 69.85,17.02 70.36,16.51 71.75,16.51 72.14,16.13 72.14,14.35 73.03,13.46 73.03,11.05 72.64,10.67 72.64,9.31 71.88,8.55 R9.1 IC2.7
N$40
  Top 0.254: JP1.7 71.12,4.57 70.1,5.59 70.1,9.14 70.36,9.4 72.01,9.4 72.14,9.53 72.14,10.97 72.03,11.07 71.22,11.07 71.12,11.18 Q7.3 IC2.12
N$41
  Top 0.254: IC5.7 72.39,16.59 72.64,16.34 72.64,14.56 73.53,13.67 73.53,7.75 IC2.8
  Bottom 0.254: IC2.8 R10.1
N$42
  Top 0.254: IC2.11 73.66,14.26 74.04,13.88 74.04,9.14 74.68,8.51 74.68,5.46 73.66,4.45 JP1.8
  Bottom 0.254: Q8.3 IC2.11
N$43
  Bottom 0.254: R8.2 69.53,11.2 Q6.1
N$44  (via drill 0.35)
  Top 0.254: IC4.2 68.83,63.5 69.6,62.74 v69.6,61.47 | v69.98,58.04 69.98,53.59 68.45,52.07 65.79,52.07 65.41,51.69 65.41,50.42 63.5,48.51 RN1.9 R28.1
  Bottom 0.254: v69.6,61.47 69.6,59.19 69.85,58.94 69.85,58.93 69.98,58.8 v69.98,58.04
N$45
  Top 0.813: JP4.1 86.87,2.54 D2.C
N$46
  Top 0.813: JP4.4 84.33,10.16 D2.A
N$47  (via drill 0.35)
  Top 0.254: v69.22,58.67 69.22,57.23 69.47,56.98 69.47,55.16 68.66,54.36 65.79,54.36 65.53,54.1 65.53,53.09 63.5,51.05 RN1.10 R29.1
  Bottom 0.254: IC4.3 68.96,60.96 69.09,60.83 69.09,58.8 v69.22,58.67
N$48
  Top 0.254: IC4.4 68.96,56.77 68.96,55.37 68.45,54.86 65.28,54.86 63.75,53.34 RN1.11 R30.1
N$49
  Top 0.254: IC4.5 RN1.12 R31.1
N$50
  Top 0.254: IC4.10 73.91,50.8 72.26,52.45 72.26,58.84 71.67,59.44 64.52,59.44 RN1.13 R32.1
N$51
  Top 0.254: IC4.11 74.17,53.34 72.77,54.74 72.77,59.05 71.88,59.94 64.52,59.94 RN1.14 R33.1
N$52
  Top 0.254: IC4.12 74.68,55.88 73.28,57.28 73.28,61.51 70.28,64.52 64.52,64.52 RN1.15 R34.1
N$53
  Top 0.254: IC4.14 74.55,60.96 70.48,65.02 64.52,65.02 RN1.16 R35.1
N$54  (3 unrouted)
N$55  (3 unrouted)
N$56  (via drill 0.35)  (1 unrouted)
  Top 0.254: IC3.15 55.47,33.88 v55.47,22.76 | v51.31,18.39 51.21,18.24 40.97,18.24 40.01,17.27 38.19,17.27 37.68,16.76 35.76,16.76 35.2,16.2 33.33,16.2 33.02,15.9 33.02,13.92 33.73,13.21 33.73,9.75 32.53,8.55 R11.1
  Bottom 0.254: v55.47,22.76 55.47,19.41 54.65,18.59 51.56,18.59 v51.31,18.39
N$57
  Top 0.813: JP4.3 88.27,0.89 82.25,0.89 R40.2
N$60  (1 unrouted)
  Bottom 0.61: U$1.VIN2 20.83,43.94 21.84,43.94 23.24,42.55 23.36,42.55
N$65
  Top 0.254: R9.2 70.17,11.2 Q7.1
N$75
  Top 0.254: IC8.11 48.87,14.58 48.87,10.87 48.56,10.57 48.56,9.54 48.26,9.24 48.26,6.2 49.53,4.93 JP6.8
  Bottom 0.254: Q16.3 IC8.11
N$76  (3 unrouted)
N$77  (3 unrouted)
N$78
  Top 0.254: R3.2 54.93,11.2 Q1.1
N$79
  Bottom 0.254: R4.2 59.37,11.2 Q2.1
N$83
  Top 0.254: JP3.5 7.37,60.2 8.64,58.93 JP13.7 10.29,58.93 11.43,60.07 16,60.07 16.89,60.96 21.59,60.96 22.48,60.07 22.48,57.53 RN5.5 RN4.5 28.83,56.77 30.82,56.77 R57.2 R39.2
N$84  (via drill 0.35)
  Top 0.254: RN5.8 RN4.2 28.83,64.39 30.82,64.39 R54.2 R43.2 | v16.26,65.28 13.21,65.28 JP13.2 11.43,66.55 10.16,65.28 8.64,65.28 6.1,67.82 JP3.2
  Bottom 0.254: RN5.8 21.59,66.04 17.02,66.04 v16.26,65.28
N$85
  Bottom 0.254: R10.2 74.61,11.2 Q8.1
N$87
  Top 0.254: IC8.18 Q9.3 31.75,11.23 31.9,11.07 32.56,11.07 32.82,10.82 32.82,9.65 32.56,9.4 30.89,9.4 30.58,9.09 30.58,5.79 31.75,4.62 JP6.1
N$88
  Top 0.254: R5.2 60.01,11.2 Q3.1
N$89  (via drill 0.35)  (1 unrouted)
  Top 0.254: IC3.1 56.19,29.52 v56.19,23.47 56.19,23.28 | v52.02,17.88 51.87,17.73 41.18,17.73 40.22,16.76 38.4,16.76 37.89,16.26 35.97,16.26 35.56,15.85 35.56,13.72 34.85,13.01 34.85,8.18 IC8.2
  Bottom 0.254: v56.19,23.47 56.19,19.41 54.66,17.88 v52.02,17.88
N$91
  Top 0.254: IC8.17 34.29,9.5 33.02,8.23 33.02,5.79 34.29,4.52 JP6.2
  Bottom 0.254: Q10.3 IC8.17
N$92  (via drill 0.35)  (1 unrouted)
  Top 0.254: IC3.2 59.69,29.49 58.17,27.96 58.17,24.54 55.01,21.38 v54.87,21.38 | R13.1 37.5,8.55 38.81,9.86 38.81,13.01 38.3,13.51 38.3,15.95 38.61,16.26 40.43,16.26 41.4,17.22 52.36,17.22 54.36,19.22 v54.36,19.25
  Bottom 0.254: v54.36,19.25 54.97,19.86 54.97,21.34 54.91,21.34 v54.87,21.38
N$93
  Top 0.254: IC8.16 Q11.3 36.83,11.12 36.88,11.07 37.59,11.07 37.8,10.87 37.8,9.65 37.54,9.4 36.02,9.4 35.56,8.94 35.56,5.79 36.83,4.52 JP6.3
N$94  (1 unrouted)
  Top 0.254: IC3.3 60.1,28.35 59.27,28.35 58.67,27.75 58.67,24.33 55.12,20.78 55.12,18.19 54.04,18.19 52.57,16.71 41.6,16.71 40.64,15.75 40.64,14.02 40.03,13.41 40.03,8.28 IC8.4
N$95
  Top 0.254: IC8.15 39.37,9.5 38.1,8.23 38.1,5.79 39.37,4.52 JP6.4
  Bottom 0.254: Q12.3 IC8.15
N$96
  Top 0.254: IC3.4 65.79,29.46 65.79,24.29 64.15,22.66 57.81,22.66 56.79,21.64 56.75,21.64 55.63,20.52 55.63,17.68 54.25,17.68 52.78,16.2 43.84,16.2 43.18,15.54 43.18,13.72 43.79,13.11 43.79,9.85 42.83,8.89 42.25,8.89 R15.1 IC8.5
N$97
  Top 0.254: IC8.14 Q13.3 41.91,11.23 42.06,11.07 42.77,11.07 42.88,10.97 42.88,9.65 42.62,9.4 41.15,9.4 40.89,9.14 40.89,5.74 41.91,4.72 JP6.5
N$98  (via drill 0.35)  (1 unrouted)
  Top 0.254: IC3.5 66.29,29.46 66.29,24.08 64.36,22.15 60.71,22.15 60.35,21.79 v60.35,21.74 | v53.75,16.15 53.75,13.71 v53.84,13.61
  Bottom 0.254: v60.35,21.74 60.05,21.74 58.67,20.42 58.67,17.83 58.12,17.27 54.86,17.27 v53.75,16.15 | v53.84,13.61 53.84,11.28 50.8,8.23 50.8,7.21 49.78,6.2 45.87,6.2 IC8.6
N$99
  Top 0.254: IC8.13 44.45,9.5 43.18,8.23 43.18,5.69 44.45,4.42 JP6.6
  Bottom 0.254: Q14.3 IC8.13
N$100  (via drill 0.35)  (1 unrouted)
  Top 0.254: IC3.6 70.87,29.46 70.87,23.98 68.53,21.64 62.23,21.64 62.03,21.44 v61.57,21.44
  Bottom 0.254: v61.57,21.44 60.71,20.57 60.71,17.33 60.14,16.76 55.32,16.76 52.73,14.17 52.73,11.99 50.38,9.64 50.38,9.62 50.16,9.4 48.62,9.4 46.99,7.77 IC8.7
N$101
  Top 0.254: IC8.12 Q15.3 46.99,11.23 47.14,11.07 47.65,11.07 48.06,10.67 48.06,9.75 47.7,9.4 46.13,9.4 45.97,9.25 45.97,6.15 46.94,5.18 46.94,3.28 JP6.7
N$102  (via drill 0.35)  (1 unrouted)
  Top 0.254: IC3.7 71.37,29.46 71.37,23.67 68.83,21.13 62.59,21.13 v62.38,20.93
  Bottom 0.254: v62.38,20.93 62.18,20.73 61.81,20.73 61.21,20.13 61.21,17.12 60.35,16.26 55.98,16.26 55.93,16.2 55.48,16.2 53.24,13.96 53.24,11.58 50.2,8.55 R18.1
N$104
  Top 0.254: R11.2 30.8,11.2 Q9.1
N$105
  Bottom 0.254: R12.2 35.24,11.2 Q10.1
N$106
  Top 0.254: R13.2 35.88,11.2 Q11.1
N$107
  Bottom 0.254: R14.2 40.32,11.2 Q12.1
N$108
  Top 0.254: R15.2 40.96,11.2 Q13.1
N$109
  Bottom 0.254: R16.2 45.4,11.2 Q14.1
N$110
  Top 0.254: R17.2 46.04,11.2 Q15.1
N$111
  Bottom 0.254: R18.2 50.48,11.2 Q16.1
OLAT
  Top 0.254: IC5.12 68.33,27.69 68.33,32.77 67.31,33.78 IC3.12 67.31,40.64 | 67.31,40.64 R21.1 | U$1.PA8 78.36,44.07 75.44,44.07 75.06,44.45 65.28,44.45 65.02,44.2 65.02,42.93 67.31,40.64
PWR_POS
  Top 0.813: R40.1 80.01,8.76 83.57,12.32 83.57,16.38 87.63,20.45 87.63,29.84 89.28,31.5 90.81,31.5 91.31,32 93.6,32 94.11,31.5 J2.8 97.28,34.29 97.28,48.01 96.01,49.27 J1.8
SCK  (via drill 0.35)
  Top 0.254: IC5.11 68.83,27.69 68.83,32.72 69.85,33.73 v69.85,34.24 IC3.11 R19.1 | v64.01,75.06 64.26,74.8 67.56,74.8 71.12,71.25 71.12,68.45 71.5,68.07 75.82,68.07 v76.07,68.33 | v76.2,62.23 76.2,61.85 76.58,61.47 v76.58,50.04 | U$1.PB3 77.47,35.56 77.47,40.01 76.07,41.4 v76.07,42.82
  Bottom 0.254: U$1.PB3 69.9,34.29 v69.85,34.24 | JP9.3 62.23,73.28 v64.01,75.06 | v76.07,68.33 76.71,67.69 76.71,62.74 v76.2,62.23 | v76.58,50.04 76.58,47.75 75.18,46.35 75.18,44.7 76.07,43.81 v76.07,42.82
SCK2  (via drill 0.35)
  Top 0.254: v44.58,48.9 44.45,49.02 v44.45,50.93 | v50.93,49.53 56.13,49.53 56.26,49.66 60.83,49.66 61.09,49.91 62.23,49.91 62.48,49.66 63.12,49.66 v63.25,49.53 | U$1.PB10 77.09,43.56 75.23,43.56 74.97,43.81 73.53,43.81 73.41,43.94 66.04,43.94 v65.79,43.69
  Bottom 0.254: IC1.7 44.32,50.8 v44.45,50.93 | v44.58,48.9 44.7,48.9 45.09,49.28 50.67,49.28 v50.93,49.53 | v63.25,49.53 66.04,49.53 IC4.7 69.09,49.02 69.09,47.62 68.58,47.12 66.93,47.12 65.79,45.97 v65.79,43.69
SLNK1  (via drill 0.35)
  Top 0.254: v65.63,32.92 62.23,36.32 IC3.14 | v73.36,32.92 73.36,32.47 73.91,31.91 73.91,28.5 74.93,27.48 IC5.9 74.93,25.65 73.66,24.38 SJ17.P$1
  Bottom 0.254: v73.36,32.92 v65.63,32.92
SLNK2
  Bottom 0.254: IC3.9 SJ16.P$1
SLNK3  (via drill 0.35)
  Top 0.254: v50.42,59.44 50.8,59.82 63.25,59.82 v63.37,59.69
  Bottom 0.254: IC1.13 48.01,59.44 v50.42,59.44 | v63.37,59.69 64.39,59.69 65.41,60.71 65.41,65.66 65.79,66.04 IC4.1
SRV1  (via drill 0.35)
  Top 0.254: v22.99,79.38 77.47,79.38 77.62,79.22 v77.72,79.22 | v77.72,75.31 77.47,75.31 77.47,73.66 U$1.PC9 79.12,72.01 79.63,72.01 80.52,71.12 82.8,71.12 83.31,71.63 84.01,71.63 R25.2
  Bottom 0.254: JP7.2 10.67,74.93 12.45,74.93 16.89,79.38 v22.99,79.38 | v77.72,79.22 v77.72,75.31
SRV2  (via drill 0.35)
  Top 0.254: v23.82,78.69 24,78.87 76.58,78.87 76.96,78.49 85.85,78.49 v85.85,78.74 | v82.7,51.82 82.55,51.97 82.55,58.04 v82.37,58.42 | v82.35,63.5 82.55,63.75 82.55,66.67 83,67.12 R24.2 84.27,67.12 85.85,68.71 v85.85,76.71
  Bottom 0.254: JP7.1 17.14,78.87 22.33,78.87 22.53,78.66 23.8,78.66 v23.82,78.69 | U$1.PC7 80.01,50.8 81.92,50.8 82.55,51.44 82.55,51.82 v82.7,51.82 | v82.37,58.42 82.55,58.8 82.55,63.25 v82.35,63.5 | v85.85,78.74 v85.85,76.71
SRV3  (via drill 0.35)  (1 unrouted)
  Top 0.254: v8.89,70.74 11.3,70.74 12.45,71.88 v12.45,72.14 | U$1.PC8 81.28,75.18 81.15,75.31 v79.12,75.31
  Bottom 0.254: JP11.2 7.11,3.81 7.11,6.6 6.48,7.24 6.48,28.36 5.84,29 5.84,52.45 6.73,53.34 6.73,70.23 7.24,70.74 v8.89,70.74 | v12.45,72.14 13.08,72.77 13.08,74.04 17.4,78.36 21.97,78.36 22.35,77.98 24.14,77.98 24.34,78.18 24.34,78.19 25.53,79.38 76.54,79.38 76.96,78.95 76.96,75.06 77.47,74.55 77.98,74.55 78.74,75.31 v79.12,75.31
SRV4  (via drill 0.35)  (1 unrouted)
  Top 0.254: v9.65,69.98 9.65,70.1 9.78,70.23 11.56,70.23 12.32,70.99 v12.45,70.87 | U$1.PC6 80.52,69.85 79.25,71.12 78.11,71.12 76.2,73.02 v76.2,75.31
  Bottom 0.254: JP11.1 10.67,2.79 9.02,2.79 7.62,4.19 7.62,7.11 6.99,7.75 6.99,28.57 6.35,29.21 6.35,52.2 7.24,53.09 7.24,69.6 7.75,70.1 9.53,70.1 v9.65,69.98 | v12.45,70.87 12.45,70.99 13.59,72.14 13.59,73.83 17.61,77.85 21.76,77.85 22.14,77.47 24.39,77.47 25.78,78.87 76.33,78.87 76.33,75.31 v76.2,75.31
SW
  Top 0.813: D1.C 90.17,67.18 L1.2 91.95,65.53 IC10.7 92.33,62.92 92.33,60.33 92.18,60.17 AP1509.2
TIN1  (via drill 0.35)
  Top 0.254: IC9.3 U$3.4 45.47,35.31 49.4,35.31 49.91,35.81 49.91,37.04 50.97,38.1 v51.56,38.1 | U$1.PB2 80.01,45.72 77.98,45.72 77.72,45.97 61.09,45.97 59.94,44.83 59.94,42.16 59.18,41.4 58,41.4 57.49,40.89 54.36,40.89 v53.72,40.26
  Bottom 0.254: v51.56,38.1 53.09,38.1 53.72,38.73 v53.72,40.26
TIN2  (via drill 0.35)
  Top 0.254: v50.55,30.86 49.91,30.23 41.66,30.23 IC9.5 | v76.45,45.26 76.45,45.34 76.33,45.47 61.42,45.47 60.45,44.49 60.45,41.78 59.56,40.89 58.21,40.89 57.7,40.39 55.12,40.39 v54.36,39.62
  Bottom 0.254: U$2.2 41.91,29.21 IC9.5 | v54.36,39.62 54.23,39.5 54.23,38.52 53.72,38.02 53.72,33.4 53.34,33.02 51.56,33.02 50.55,32 v50.55,30.86 | U$1.PB1 80.01,45.72 76.96,45.72 v76.45,45.26
TIN3  (via drill 0.35)
  Top 0.254: v77.29,44.76 77.11,44.58 75.82,44.58 75.44,44.96 61.76,44.96 60.96,44.16 60.96,41.4 59.94,40.39 58.42,40.39 57.91,39.88 55.75,39.88 54.99,39.12 v54.99,38.86
  Bottom 0.254: U$2.4 44.58,21.59 46.63,23.65 46.63,27.58 IC9.10 48.77,29.21 49.78,30.23 50.93,30.23 51.18,30.48 51.18,31.92 51.77,32.51 53.55,32.51 54.23,33.19 54.23,37.81 54.99,38.57 v54.99,38.86 | U$1.PB15 80.01,43.18 78.03,43.18 77.29,43.92 v77.29,44.76
TIN4
  Top 0.254: U$1.PB12 81.28,53.85 80.01,52.58 80.01,49.02 79.25,48.26 78.23,48.26 77.34,47.37 77.34,46.99 76.83,46.48 60.71,46.48 59.44,45.21 59.44,42.55 58.8,41.91 57.78,41.91 57.28,41.4 53.84,41.4 52.83,40.39 46.99,40.39 45.97,39.37 U$3.2
  Bottom 0.254: U$3.2 46.35,39.37 46.35,34.29 IC9.12
TIN5
  Top 0.254: U$5.4 IC6.3 U$1.PA4
TIN6
  Top 0.254: U$1.PC0 20.83,26.67 23.37,29.21 IC6.5
  Bottom 0.254: IC6.5 24.77,29.21 27.3,26.67 U$4.2
TIN7  (via drill 0.35)
  Top 0.254: U$1.PC3 17.78,26.04 18.92,24.89 v21.34,24.89
  Bottom 0.254: IC6.10 30.1,27.56 30.1,23.11 28.57,21.59 U$4.4 23.37,21.59 21.34,23.62 v21.34,24.89
TIN8
  Top 0.254: U$1.PA0 21.84,39.37 22.86,40.39 26.92,40.39 U$5.2
  Bottom 0.254: 30.99,34.29 IC6.12 31.75,34.67 30.1,36.32 30.1,38.1 28.83,39.37 U$5.2
TOUT1
  Top 0.406: JP5.1 6.93,23.88 JP15.1 10.67,25.15 13.72,25.15 17.75,21.11 21.11,21.11 IC6.7 25.4,25.4 34.29,25.4 U$4.7
TOUT2
  Top 0.254: IC6.8 32.26,24.13 34.8,21.59 U$4.5
  Top 0.406: U$4.5 34.92,20.95 32.77,20.95 32.56,20.75 29.64,20.75 29.34,20.45 17.14,20.45 13.72,23.88 JP15.2 11.3,23.88 10.03,22.61 6.35,22.61 3.91,25.04 JP5.2
  Bottom 0.406: JP5.2 3.08,25.15
TOUT3  (via drill 0.35)
  Top 0.254: 24.26,39.37 IC6.1 25.65,39.37 26.67,38.35 36.45,38.35 37.34,37.47 37.34,35.18 36.45,34.29 U$5.5
  Top 0.406: JP5.3 4.39,21.34 JP15.3 10.03,21.34 11.3,22.61 13.72,22.61 16.54,19.79 29.69,19.79 30,20.09 33.3,20.09 v33.4,20.19 | v38.1,21.34 38.1,21.36 38.2,21.46 38.2,33.4 37.31,34.29 U$5.5
  Bottom 0.406: v38.1,21.34 36.96,20.19 v33.4,20.19
TOUT4
  Top 0.254: IC6.14 U$5.7
  Top 0.406: JP5.4 3.08,20.07 10.03,20.07 11.3,21.34 JP15.4 13.72,21.34 15.93,19.13 29.97,19.13 30.27,19.43 33.86,19.43 34.42,19.99 36.34,19.99 36.85,20.5 38.61,20.5 38.86,20.75 38.86,37.08 36.58,39.37 U$5.7
TOUT5
  Top 0.406: JP5.5 4.39,16.26 JP15.7 10.67,17.53 12.95,17.53 14.78,15.7 27.5,15.7 30.57,18.77 34.13,18.77 34.69,19.33 36.62,19.33 37.12,19.84 38.95,19.84 40.64,21.53 IC9.7 41.91,25.4 50.67,25.4 51.94,26.67 U$2.7
TOUT6
  Top 0.254: 52.07,21.39 U$2.5 50.8,21.59 IC9.8
  Top 0.406: JP5.6 3.08,14.99 10.03,14.99 11.3,16.26 JP15.8 12.95,16.26 14.17,15.04 27.77,15.04 30.85,18.11 34.41,18.11 34.97,18.67 36.89,18.67 37.4,19.18 39.22,19.18 40.19,20.14 49.77,20.14 51.22,21.59 U$2.5
TOUT7  (via drill 0.35)
  Top 0.254: v50.16,38.35 42.55,38.35 42.55,39.37 IC9.1
  Top 0.406: JP5.7 4.6,13.72 JP15.9 10.03,13.72 11.3,14.99 12.83,14.99 13.44,14.38 28.05,14.38 31.12,17.45 34.68,17.45 35.24,18.01 37.16,18.01 37.67,18.52 39.49,18.52 40.46,19.48 50.05,19.48 50.37,19.81 52.45,19.81 v52.58,19.91 | U$3.5 52.58,34.29 54.23,32.64 54.23,23.77 v54.21,23.75
  Bottom 0.254: U$3.5 50.16,34.29 v50.16,38.35
  Bottom 0.406: v54.21,23.75 54.21,21.69 54.18,21.67 54.18,20.27 53.87,19.91 v52.58,19.91
TOUT8
  Top 0.254: IC9.14 U$3.7
  Top 0.406: JP5.8 3.83,9.8 6.35,12.32 10.03,12.32 11.43,13.72 JP15.10 28.32,13.72 31.39,16.79 34.95,16.79 35.51,17.35 37.44,17.35 37.95,17.86 39.77,17.86 40.73,18.82 50.32,18.82 50.64,19.15 53.18,19.15 54.18,20.15 54.18,22.43 54.89,23.14 54.89,36.55 U$3.7
V+  (via drill 0.35)
  Top 0.254: v88.77,58.93 90.49,58.93 AP1509.3 90.54,58.93 92.2,58.93 93.22,59.94 93.22,69.85
  Top 0.61: U$1.E5V 20.62,67.61 31.75,67.61 32.11,67.26 47.24,67.26 47.72,67.74 52.38,67.74 v52.45,67.82 | v56.52,78.11 74.93,78.11 75.31,77.72 88.59,77.72 C1.1
  Top 0.813: C2.+ 93.22,69.85 92.08,69.85 90.17,71.75 L1.1 90.17,72.52 90.55,72.9 90.55,75.41 C1.1
  Bottom 0.254: v88.77,58.93 89.41,58.29 IC10.1
  Bottom 0.61: v52.45,67.82 53.59,68.83 55.58,70.81 55.61,70.81 57.66,72.86 57.66,76.96 v56.52,78.11

## Text on the board
tNames: JP4: / PWR / =OUT / || IN / :: LOC